# EAGLE design ap_hand_controller_v2 (EAGLE 7.7.0)
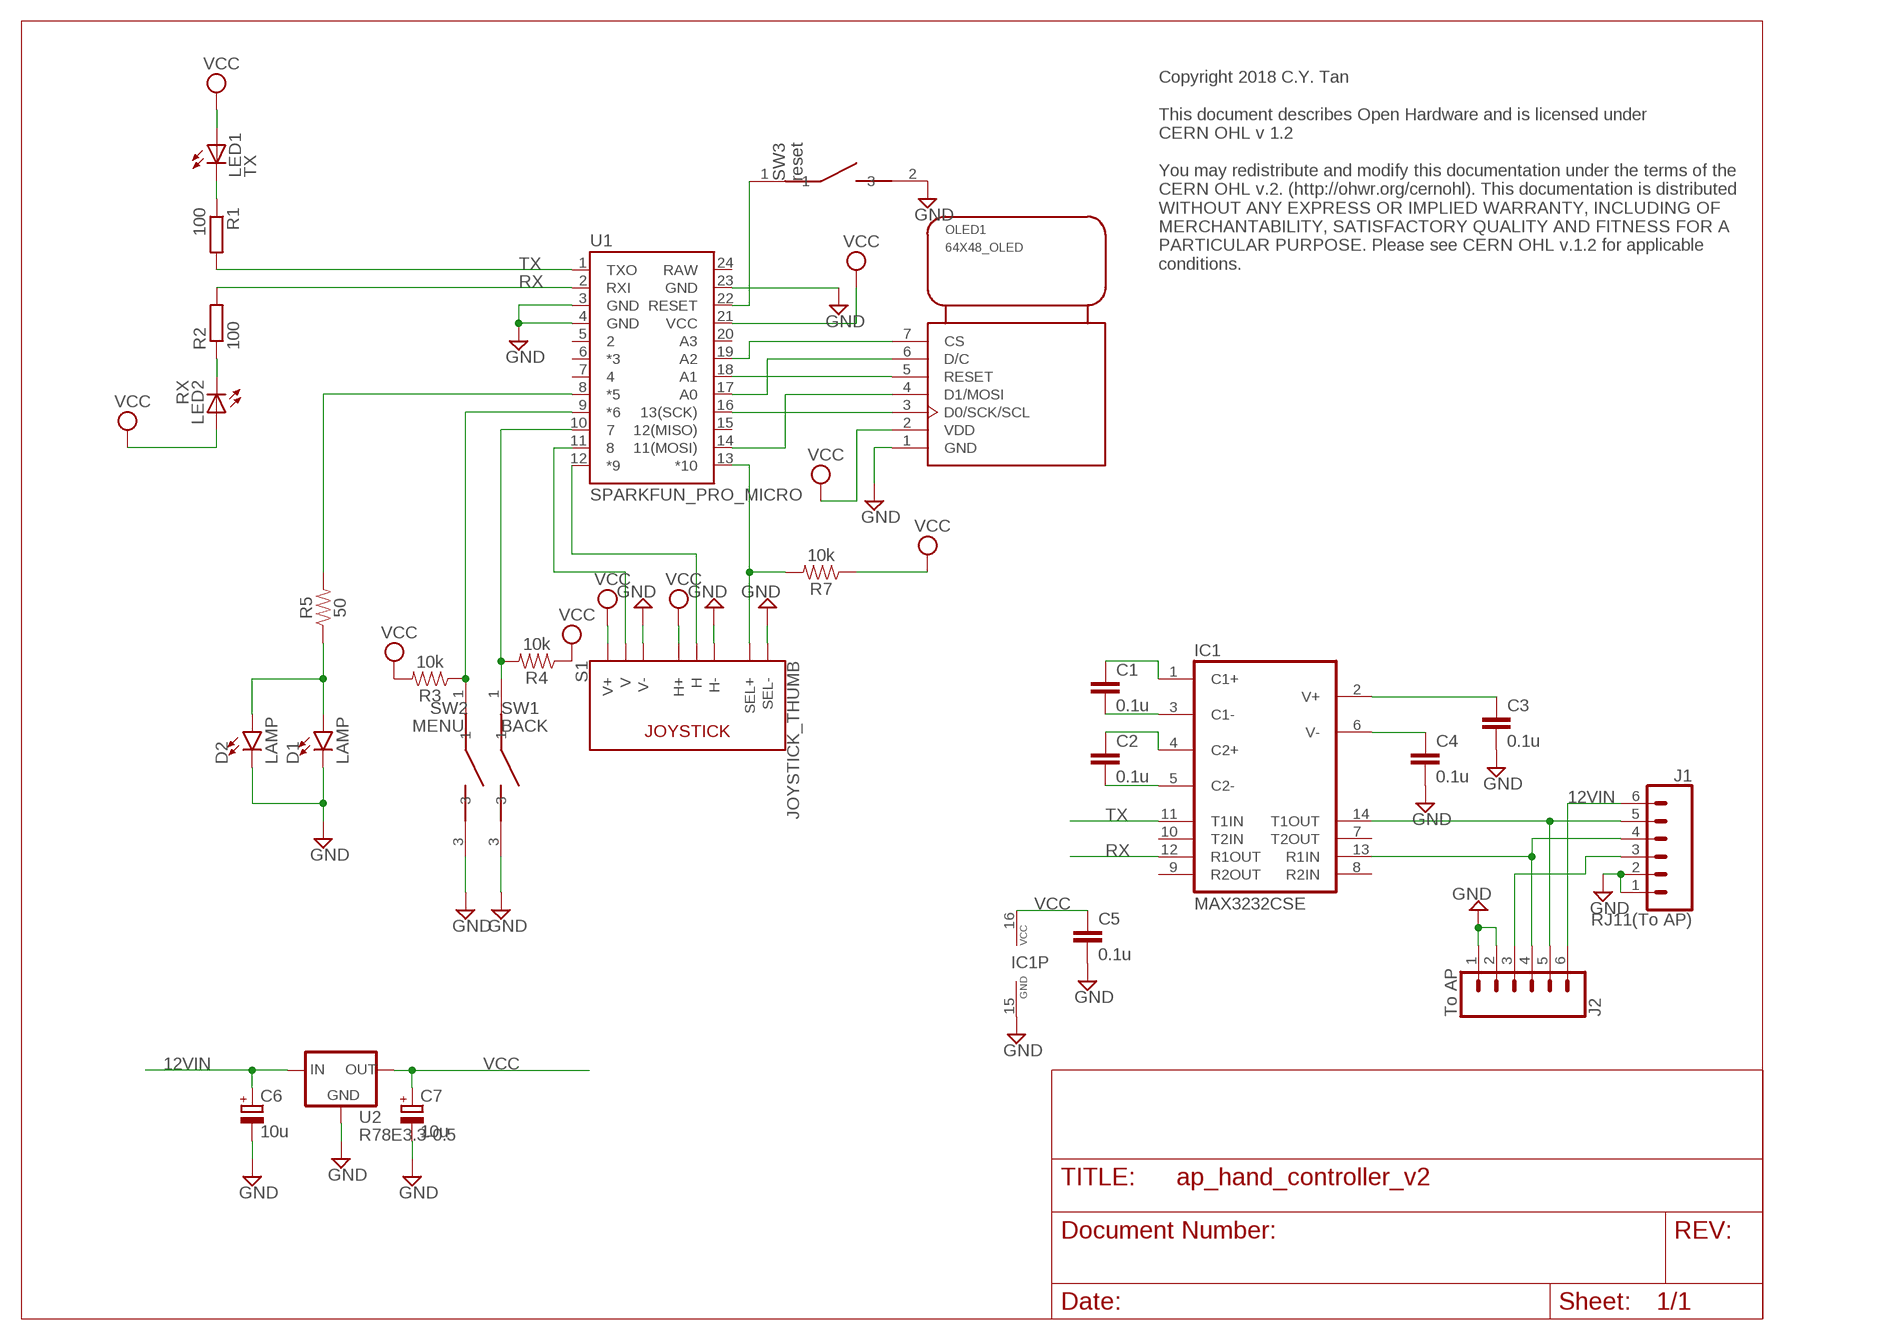
[diagram p0: schematic, sheet 1]

## Parts
C1  0.1u  C-EUC1206  [C1206]
C2  0.1u  C-EUC1206  [C1206]
C3  0.1u  C-EUC1206  [C1206]
C4  0.1u  C-EUC1206  [C1206]
C5  0.1u  C-EUC1206  [C1206]
C6  10u  CPOL-EUE2.5-6  [E2,5-6]
C7  10u  CPOL-EUE2.5-6  [E2,5-6]
D1  LAMP  LED5MM  [LED_5MM]
D2  LAMP  LED5MM  [LED_5MM]
IC1  MAX3232CSE  [SO16]
J1  RJ11(To AP)  RJ11-6  [RJ11-6]
J2  To AP  CONN_06NO_SILK_FEMALE_PTH  [1X06_NO_SILK]
LED1  TX  LEDCHIPLED_1206  [CHIPLED_1206]
LED2  RX  LEDCHIPLED_1206  [CHIPLED_1206]
OLED1  64X48_OLED  [64X48_OLED]
R1  100  R  [R0805]
R2  100  R  [R0805]
R3  10k  RESISTORAXIAL-0.3  [AXIAL-0.3]
R4  10k  RESISTORAXIAL-0.3  [AXIAL-0.3]
R5  50  RESISTORAXIAL-0.3  [AXIAL-0.3]
R7  10k  RESISTORAXIAL-0.3  [AXIAL-0.3]
S1  JOYSTICK_THUMB  [JOYSTICK]
SW1  BACK  TSA12110_TACT_SWITCH  [TSA12110_TACT_SWITCH]
SW2  MENU  TSA12110_TACT_SWITCH  [TSA12110_TACT_SWITCH]
SW3  reset  TACTILE_SWITCH_90DEG  [TACTILE_SWITCH_90DEG]
U1  SPARKFUN_PRO_MICRO  [SPARKFUN_PRO_MICRO]
U2  R78E3.3-0.5  R-78E5.0-1.0  [DC-DC_CONVERTER_78XX]

## Nets
12VIN: C6.+ J1.6 J2.6 U2.VIN(IN)
GND: C3.2 C4.2 C5.2 C6.- C7.- D1.K(C) D2.K(C) IC1.15(GND) J1.1 J1.2 J2.1 J2.2 OLED1.1(GND) S1.B2A(SEL-) S1.H3(H-) S1.V3(V-) SW1.3 SW2.3 SW3.2 U1.3(GND) U1.4(GND) U1.23(GND) U2.GND
N$1: C1.1 IC1.1(C1+)
N$2: C1.2 IC1.3(C1-)
N$3: C2.1 IC1.4(C2+)
N$4: C2.2 IC1.5(C2-)
N$5: C4.1 IC1.6(V-)
N$6: C3.1 IC1.2(V+)
N$7: IC1.14(T1OUT) J1.5 J2.5
N$8: IC1.13(R1IN) J1.4 J2.4
N$9: LED1.C R1.1
N$10: LED2.C R2.1
N$11: S1.V2(V) U1.11
N$12: S1.H2(H) U1.12(*9)
N$13: SW3.1 U1.22(RESET)
N$14: OLED1.3(D0/SCK/SCL) U1.16(13(SCK))
N$15: OLED1.6(D/C) U1.17(A0)
N$16: OLED1.4(D1/MOSI) U1.14(11(MOSI))
N$17: OLED1.5(RESET) U1.18(A1)
N$18: OLED1.7(CS) U1.19(A2)
N$21: R4.P$2 SW1.1 U1.10
N$22: R3.P$1 SW2.1 U1.9(*6)
N$24: D1.A D2.A R5.P$1
N$30: R7.P$2 S1.B1A(SEL+) U1.13(*10)
N$31: J1.3 J2.3
N$32: R5.P$2 U1.8(*5)
RX: IC1.12(R1OUT) R2.2 U1.2(RXI)
TX: IC1.11(T1IN) R1.2 U1.1(TXO)
VCC: C5.1 C7.+ IC1.16(VCC) LED1.A LED2.A OLED1.2(VDD) R3.P$2 R4.P$1 R7.P$1 S1.H1(H+) S1.V1(V+) U1.21(VCC) U2.VOUT(OUT)
Unconnected: IC1.7(T2OUT) IC1.8(R2IN) IC1.9(R2OUT) IC1.10(T2IN) U1.5 U1.6(*3) U1.7 U1.15(12(MISO)) U1.20(A3)

## Notes on the sheet
- Copyright 2018 C.Y. Tan
  
  This document describes Open Hardware and is licensed under
  CERN OHL v 1.2
  
  You may redistribute and modify this documentation under the terms of the 
  CERN OHL v.2. (http://ohwr.org/cernohl). This documentation is distributed
  WITHOUT ANY EXPRESS OR IMPLIED WARRANTY, INCLUDING OF
  MERCHANTABILITY, SATISFACTORY QUALITY AND FITNESS FOR A
  PARTICULAR PURPOSE. Please see CERN OHL v.1.2 for applicable
  conditions.

## Power pins joined to a net without a drawn wire
RAW: U1.24(RAW)

## Library data of the parts
C1-C5 = resistor:C-EU: CAPACITOR, European symbol
C6 C7 = resistor:CPOL-EU: POLARIZED CAPACITOR, European symbol
D1 D2 = SparkFun-LED:LED: LED (Generic) Standard schematic elements and footprints for 5mm, 3mm, 1206, and 0603 sized LEDs. Generic LEDs with no color specified.
IC1 = maxim:MAX3232*: True RS-232 Transceivers 3.0V to 5.5V, Low-Power up to 1Mbps, Using Four 0.1µF External Capacitors Source: http://pdfserv.maxim-ic.com/en/ds/MAX3222-MAX3241.pdf; MPN: MAX3232CSE; OC_FARNELL: 9725490; OC_NEWARK: 90C2890
J1 = SparkFun-Connectors:RJ11-6: RJ11 Jack - 6 pin Commonly found on CAT3 devices and some Microchip programmers. Here is the connector we sell at SparkFun: RJ11 6-Pin Connector <https://www.sparkfun.com/products/132> (PRT-00132) Datasheet <http://www.sparkfun.com/datasheets/Prototyping/Connectors/RJ11-Datasheet.pdf> It is used on this SparkFun product: SparkFun Weather Shield <https://www.sparkfun.com/products/12081> (DEV-12081) Weather Meters <https://www.sparkfun.com/products/8942> (SEN-08942); PROD_ID: CONN-08590; SF_ID: PRT-00132; VALUE: RJ11
J2 = SparkFun-Connectors:CONN_06: Multi connection point. Often used as Generic Header-pin footprint for 0.1 inch spaced/style header connections On any of the 0.1 inch spaced packages, you can populate with these: Break Away Headers - Straight <https://www.sparkfun.com/products/116> (PRT-00116) Break Away Male Headers - Right Angle <https://www.sparkfun.com/products/553> (PRT-00553) Female Headers <https://www.sparkfun.com/products/115> (PRT-00115) Break Away Headers - Machine Pin <https://www.sparkfun.com/products/117> (PRT-00117) Break Away Female Headers - Swiss Machine Pin <https://www.sparkfun.com/products/743> (PRT-00743) Arduino Stackable Header - 6 Pin <https://www.sparkfun.com/products/9280> (PRT-09280) For SCREWTERMINALS and SPRING TERMINALS visit here: Screw Terimnals on SparkFun.com <https://www.sparkfun.com/search/results?term=Screw+Terminals> (5mm/3.5mm/2.54mm spacing) This device is also useful as a general connection point to wire up your design to another part of your project. Our various solder wires solder well into these plated through hole pads. Hook-Up Wire - Assortment (Stranded, 22 AWG) <https://www.sparkfun.com/products/11375> (PRT-11375) Hook-Up Wire - Assortment (Solid Core, 22 AWG) <https://www.sparkfun.com/products/11367> (PRT-11367) View the entire wire category on our website here <https://www.sparkfun.com/categories/141>; PROD_ID: CONN-08437
LED1 LED2 = led:LED: LED OSRAM: - CHIPLED LG R971, LG N971, LY N971, LG Q971, LY Q971, LO R971, LY R971 LH N974, LH R974 LS Q976, LO Q976, LY Q976 LO Q996 - Hyper CHIPLED LW Q18S LB Q993, LB Q99A, LB R99A - SideLED LS A670, LO A670, LY A670, LG A670, LP A670 LB A673, LV A673, LT A673, LW A673 LH A674 LY A675 LS A676, LA A676, LO A676, LY A676, LW A676 LS A679, LY A679, LG A679 - Hyper Micro SIDELED® LS Y876, LA Y876, LO Y876, LY Y876 LT Y87S - SmartLED LW L88C, LW L88S LB L89C, LB L89S, LG L890 LS L89K, LO L89K, LY L89K LS L896, LA L896, LO L896, LY L896 - TOPLED LS T670, LO T670, LY T670, LG T670, LP T670 LSG T670, LSP T670, LSY T670, LOP T670, LYG T670 LG T671, LOG T671, LSG T671 LB T673, LV T673, LT T673, LW T673 LH T674 LS T676, LA T676, LO T676, LY T676, LB T676, LH T676, LSB T676, LW T676 LB T67C, LV T67C, LT T67C, LS T67K, LO T67K, LY T67K, LW E67C LS E67B, LA E67B, LO E67B, LY E67B, LB E67C, LV E67C, LT E67C LW T67C LS T679, LY T679, LG T679 LS T770, LO T770, LY T770, LG T770, LP T770 LB T773, LV T773, LT T773, LW T773 LH T774 LS E675, LA E675, LY E675, LS T675 LS T776, LA T776, LO T776, LY T776, LB T776 LHGB T686 LT T68C, LB T68C - Hyper Mini TOPLED® LB M676 - Mini TOPLED Santana® LG M470 LS M47K, LO M47K, LY M47K Source: http://www.osram.convergy.de LUXEON: - LUMILED® LXK2-PW12-R00, LXK2-PW12-S00, LXK2-PW14-U00, LXK2-PW14-V00 LXK2-PM12-R00, LXK2-PM12-S00, LXK2-PM14-U00 LXK2-PE12-Q00, LXK2-PE12-R00, LXK2-PE12-S00, LXK2-PE14-T00, LXK2-PE14-U00 LXK2-PB12-K00, LXK2-PB12-L00, LXK2-PB12-M00, LXK2-PB14-N00, LXK2-PB14-P00, LXK2-PB14-Q00 LXK2-PR12-L00, LXK2-PR12-M00, LXK2-PR14-Q00, LXK2-PR14-R00 LXK2-PD12-Q00, LXK2-PD12-R00, LXK2-PD12-S00 LXK2-PH12-R00, LXK2-PH12-S00 LXK2-PL12-P00, LXK2-PL12-Q00, LXK2-PL12-R00 Source: www.luxeon.com KINGBRIGHT: KA-3528ASYC Source: www.kingbright.com
OLED1 = cytan:64X48_OLED: Sparkfun Micro OLED Breakout
R1 R2 = eagle-ltspice:R: RESISTOR, European symbol; SPICEMODEL: NONE; SPICEPREFIX: R
R3-R5 R7 = SparkFun-Resistors:RESISTOR: Generic Resistor Package
S1 = SparkFun-Switches:JOYSTICK_THUMB: Analog Thumb Joystick This is a joystick very similar to the ‘analog’ joysticks on PS2 (PlayStation 2) controllers. Directional movements are simply two potentiometers - one for each axis. Pots are ~10k each. This joystick also has a select button that is actuated when the joystick is pressed down. SparkFun Products Thumb Joystick <https://www.sparkfun.com/products/9032> (COM-09032) SparkFun Thumb Joystick Breakout <https://www.sparkfun.com/products/9110> (BOB-09110) SparkFun Joystick Shield Kit <https://www.sparkfun.com/products/9760> (DEV-09760); PROD_ID: COMP-09744; SF_SKU: COM-09032
SW1 SW2 = cytan:TSA12110_TACT_SWITCH: TSA12110 Tactile Switch
SW3 = cytan:TACTILE_SWITCH_90DEG: Tactile switch 90 deg SPST-NO
U1 = SparkFun-Boards:SPARKFUN_PRO_MICRO: SparkFun Pro Micro Atmega32U4 compatible footprint. SparkFun Products: 3.3V/8MHz <https://www.sparkfun.com/products/12587> 5V/16MHz <https://www.sparkfun.com/products/12640>
U2 = SparkFun-IC-Power:R-78E5.0-1.0: Recom Power 5V 1A DC/DC Converter The Recom R-78E5.0-X.X is a compact DC/DC converter module that is a pin for pin drop-in replacement for the LM7805 linear voltage regulator. Specifications: Input Range: 7-28V Output Voltage: 5V Output Current: 1A Max Efficiency: 91% Datasheet <https://www.recom-power.com/pdf/Innoline/R-78Exx-1.0.pdf>; PROD_ID: COM-13655

## Board
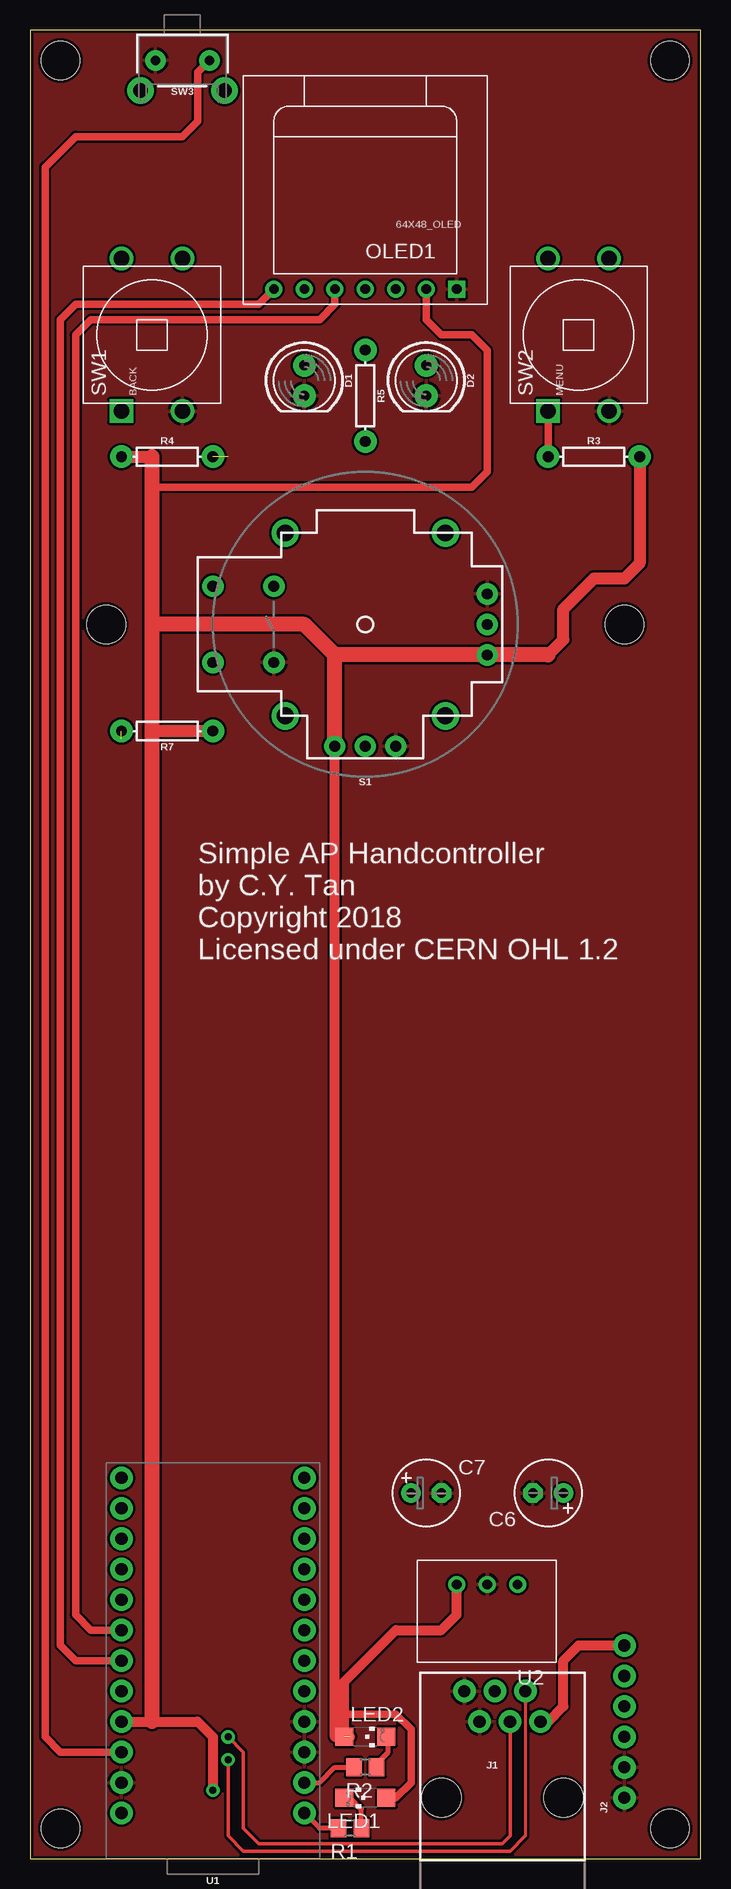
[diagram p1: board, top side]
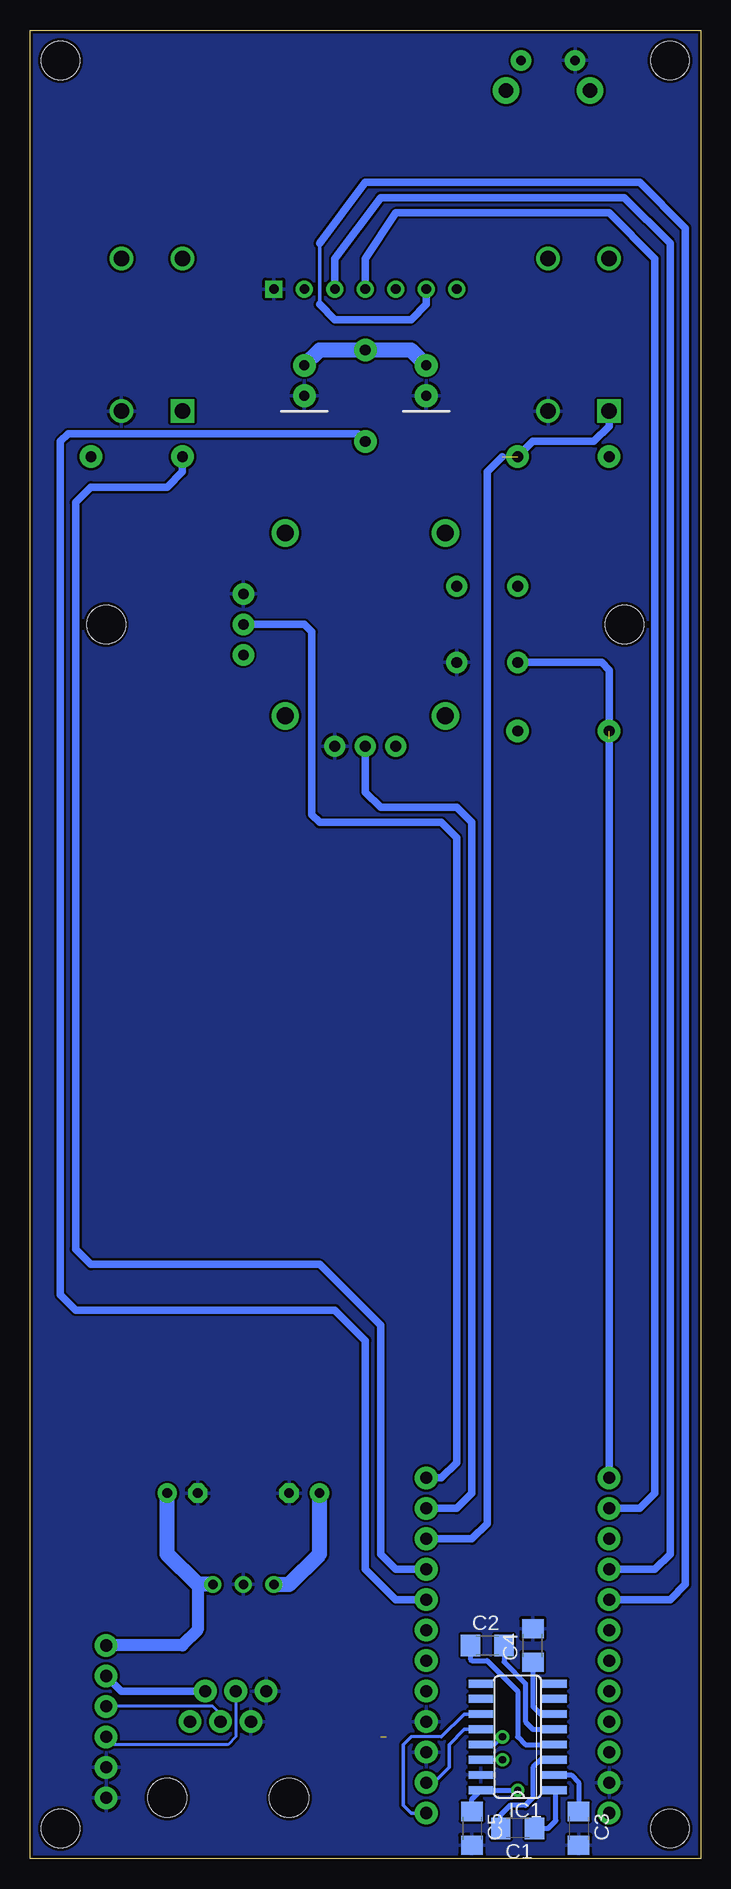
[diagram p2: board, bottom side, seen from below]

Size 55.88 x 152.4 mm. Coordinates in mm from the lower left corner, seen from the top.
Outline: 0,0 55.88,0 55.88,152.4 0,152.4 0,0
Copper layers (1*16): Top 0.035mm / dielectric 1.5mm / Bottom 0.035mm
Design rules "SparkFun": minimum track width 8mil, minimum drill 20mil, track to track 8mil, track to pad 8mil, pad to pad 8mil, via to via 8mil, smd to smd 8mil, copper to edge 10mil, drill to drill 8mil, minimum pad ring 12mil, minimum via ring 10mil, stop-mask expansion 4mil, vias tented up to drill 25mil, thermal gap 10mil
Holes 3.2 mm at 2.54,2.54 53.34,2.54 53.34,149.86 2.54,149.86 6.35,102.87 49.53,102.87

### Footprints (pad centres in the part's own frame; a part is rotated, then mirrored left to right if it is on the bottom)
C1206 = smd 1.6 x 1.8: 1 -1.4,0; 2 1.4,0
E2,5-6 = drill 0.813 pad 1.6: + -1.27,0 | drill 0.813 pad 1.6 octagon: - 1.27,0
LED_5MM = drill 0.813 pad 1.88: A -1.27,0; K 1.27,0
SO16 = smd 0.66 x 2.032: 1 -4.445,-3.073; 2 -3.175,-3.073; 3 -1.905,-3.073; 4 -0.635,-3.073; 5 0.635,-3.073; 6 1.905,-3.073; 7 3.175,-3.073; 8 4.445,-3.073; 9 4.445,3.073; 10 3.175,3.073; 11 1.905,3.073; 12 0.635,3.073; 13 -0.635,3.073; 14 -1.905,3.073; 15 -3.175,3.073; 16 -4.445,3.073
RJ11-6 = drill 1.016 pad 1.88: 1 -3.175,8.89; 2 -1.905,6.35; 3 -0.635,8.89; 4 0.635,6.35; 5 1.905,8.89; 6 3.175,6.35 | hole 3.251: -5.08,0; 5.08,0
1X06_NO_SILK = drill 1.016 pad 1.88: 1 0,0; 2 2.54,0; 3 5.08,0; 4 7.62,0; 5 10.16,0; 6 12.7,0
CHIPLED_1206 = smd 1.5 x 1.5: A 0,-1.75; C 0,1.75
64X48_OLED = drill 0.8 square: 1 -7.62,6.35 | drill 0.8: 2 -5.08,6.35; 3 -2.54,6.35; 4 0,6.35; 5 2.54,6.35; 6 5.08,6.35; 7 7.62,6.35
R0805 = smd 1.3 x 1.5: 1 -0.95,0; 2 0.95,0
AXIAL-0.3 = drill 0.9 pad 1.88: P$1 -3.81,0; P$2 3.81,0
JOYSTICK = drill 0.9 pad 1.778: B1A -3.175,12.7; B1B 3.175,12.7; B2A -3.175,7.62; B2B 3.175,7.62 | drill 0.889 pad 1.778: H1 -2.54,-10.16; H2 0,-10.16; H3 2.54,-10.16; V1 -10.16,2.54; V2 -10.16,0; V3 -10.16,-2.54 | drill 1.397 pad 2.286: MOUNT1 -7.62,6.668; MOUNT2 -7.62,-6.668; MOUNT3 7.62,-6.668; MOUNT4 7.62,6.668
TSA12110_TACT_SWITCH = drill 1.3 square: 1 -6.35,2.54 | drill 1.3: 2 6.35,2.54; 3 -6.35,-2.54; 4 6.35,-2.54
TACTILE_SWITCH_90DEG = drill 0.8 pad 1.7: 1 -2.25,0; 2 2.25,0 | drill 1.2 pad 2.2: ANCHOR1 -3.5,2.5; ANCHOR2 3.5,2.5
SPARKFUN_PRO_MICRO = drill 1.016 pad 1.88: 1 -7.62,12.7; 2 -7.62,10.16; 3 -7.62,7.62; 4 -7.62,5.08; 5 -7.62,2.54; 6 -7.62,0; 7 -7.62,-2.54; 8 -7.62,-5.08; 9 -7.62,-7.62; 10 -7.62,-10.16; 11 -7.62,-12.7; 12 -7.62,-15.24; 13 7.62,-15.24; 14 7.62,-12.7; 15 7.62,-10.16; 16 7.62,-7.62; 17 7.62,-5.08; 18 7.62,-2.54; 19 7.62,0; 20 7.62,2.54; 21 7.62,5.08; 22 7.62,7.62; 23 7.62,10.16; 24 7.62,12.7
DC-DC_CONVERTER_78XX = drill 0.8: GND 0,0; VIN -2.54,0; VOUT 2.54,0

### Placement (x,y rotation side)
C1  15.24,2.54 180 bottom
C2  17.78,17.78 0 bottom
C3  10.16,2.54 270 bottom
C4  13.97,17.78 90 bottom
C5  19.05,2.54 270 bottom
C6  43.18,30.48 180 top
C7  33.02,30.48 0 top
D1  22.86,123.19 270 top
D2  33.02,123.19 270 top
IC1  15.24,10.16 90 bottom
J1  39.37,5.08 0 top
J2  49.53,5.08 90 top
LED1  27.94,5.08 90 top
LED2  27.94,10.16 270 top
OLED1  27.94,137.16 180 top
R1  26.67,2.54 180 top
R2  27.94,7.62 180 top
R3  46.99,116.84 0 top
R4  11.43,116.84 0 top
R5  27.94,121.92 270 top
R7  11.43,93.98 180 top
S1  27.94,102.87 90 top
SW1  10.16,127 90 top
SW2  45.72,127 90 top
SW3  12.7,149.86 180 top
U1  15.24,16.51 180 top
U2  38.1,22.86 180 top

### Tracks (layer width: path | path; a pad name or v marks a point on that pad's centre or on a via)
12VIN
  Top 0.813: J1.6 43.18,11.43 44.45,12.7 44.45,16.51 45.72,17.78 J2.6
  Bottom 1.016: 41.91,22.86 41.91,19.05 43.18,17.78 J2.6
  Bottom 1.27: U2.VIN 41.91,22.86 44.45,25.4 C6.+
GND
  pour Bottom: 0,152.4 55.88,152.4 55.88,0 0,0
  pour Top: 0,152.4 55.88,152.4 55.88,0 0,0
N$1
  Bottom 0.406: C1.1 12.7,2.54 12.06,3.17 12.06,5.61 IC1.1
N$2
  Bottom 0.406: C1.2 16.64,3.68 15.88,4.45 14.61,4.45 13.97,5.08 13.97,7.62 13.34,8.26 IC1.3
N$3
  Bottom 0.406: C2.1 19.18,16.64 19.05,16.51 17.78,16.51 15.24,13.97 15.24,10.16 14.61,9.53 IC1.4
N$4
  Bottom 0.406: C2.2 16.38,16.38 14.61,14.61 14.61,11.43 13.97,10.79 IC1.5
N$5
  Bottom 0.406: 12.06,12.06 IC1.6 13.34,12.06 13.97,12.7 C4.1
N$6
  Bottom 0.406: IC1.2 10.79,6.99 10.16,6.35 C3.1
N$7  (via drill 0.6)
  Top 0.254: J1.5 41.27,1.91
  Top 0.305: 41.27,1.91 40.01,0.64 17.78,0.64 16.51,1.91 v16.51,8.26
  Bottom 0.305: IC1.14 v16.51,8.26
  Bottom 0.61: J1.5 48.26,13.97 J2.5
N$8  (via drill 0.6)
  Top 0.305: J1.4 40.01,1.91 39.37,1.27 19.05,1.27 17.78,2.54 17.78,8.89 v16.51,10.16
  Bottom 0.254: J1.4 40.01,12.06 40.64,12.7 J2.4
  Bottom 0.305: IC1.13 17.14,9.53 v16.51,10.16
N$9
  Top 0.406: R1.1 27.62,4.13 26.67,5.08 LED1.C
N$10
  Top 0.406: R2.1 28.89,7.93 29.84,8.89 29.84,10.01 LED2.C
N$11
  Bottom 0.61: S1.V2 27.94,88.9 26.67,87.63 20.32,87.63 19.05,86.36 19.05,30.48 20.32,29.21 U1.11
N$12
  Bottom 0.61: S1.H2 33.02,102.87 32.38,102.23 32.38,87 31.75,86.36 21.59,86.36 20.32,85.09 20.32,33.02 21.59,31.75 U1.12
N$13
  Top 0.61: U1.22 2.54,8.89 1.27,10.16 1.27,140.97 3.81,143.51 12.7,143.51 13.97,144.78 13.97,148.88 SW3.1
N$14
  Bottom 0.61: U1.16 3.81,24.13 2.54,25.4 2.54,134.62 6.35,138.43 26.67,138.43 30.48,133.35 OLED1.3 30.48,132.08
N$15
  Bottom 0.305: 31.75,134.62 31.75,129.54
  Bottom 0.61: 31.75,134.62 27.94,139.7 5.08,139.7 1.27,135.89 1.27,22.86 2.54,21.59 U1.17 | 31.75,129.54 30.48,128.27 24.13,128.27 22.86,129.54 OLED1.6
N$16
  Bottom 0.61: U1.14 5.08,29.21 3.81,30.48 3.81,133.35 7.62,137.16 25.4,137.16 27.94,133.35 OLED1.4
N$17
  Top 0.61: U1.18 5.08,19.05 3.81,20.32 3.81,127 5.08,128.27 24.13,128.27 25.4,129.54 OLED1.5
N$18
  Top 0.61: U1.19 3.81,16.51 2.54,17.78 2.54,128.27 3.81,129.54 19.05,129.54 OLED1.7
N$21  (1 unrouted)
  Bottom 0.61: 16.51,116.84 17.78,115.57 17.78,27.94 19.05,26.67 U1.10 | SW1.1 7.62,119.38 8.89,118.11 13.97,118.11 R4.P$2
N$22
  Top 0.61: SW2.1 R3.P$1
  Bottom 0.61: U1.9 25.4,24.13 26.67,25.4 26.67,44.45 31.75,49.53 50.8,49.53 52.07,50.8 52.07,113.03 50.8,114.3 44.45,114.3 43.18,115.57 R3.P$1
N$24
  Bottom 1.27: D1.A 24.13,125.73 R5.P$1 31.75,125.73 D2.A
N$30  (1 unrouted)
  Bottom 0.61: U1.13 7.62,93.34 | S1.B1A 8.26,99.69 7.62,99.06 R7.P$2
N$31
  Bottom 0.254: J1.3 38.73,10.16 39.37,9.53 48.9,9.53 J2.3
N$32
  Bottom 0.61: U1.8 25.4,21.59 27.94,24.13 27.94,43.18 30.48,45.72 52.07,45.72 53.34,46.99 53.34,118.11 52.7,118.75 28.57,118.75 R5.P$2
RX
  Top 0.406: U1.2 24.13,6.35 25.4,7.62 R2.2
  Bottom 0.305: IC1.12 19.68,10.79 20.95,9.53 20.95,7.62 22.23,6.35 U1.2
TX
  Top 0.406: R1.2 24.13,2.54 U1.1
  Bottom 0.254: 21.59,10.16 24.13,10.16
  Bottom 0.305: 19.05,12.06 19.68,12.06 21.59,10.16 | 24.13,10.16 24.77,9.53 24.77,4.45 24.13,3.81 U1.1
  Bottom 0.406: IC1.11 19.05,12.06
VCC  (via drill 0.6)  (1 unrouted)
  Top 0.61: LED1.A 30.48,5.08 31.75,6.35 31.75,10.79 30.48,12.06 26.19,12.06 | OLED1.2 33.02,128.27 34.29,127 36.83,127 38.1,125.73 38.1,115.57 36.83,114.3 10.16,114.3
  Top 0.813: LED2.A 26.19,12.06 26.19,14.76 30.48,19.05 34.29,19.05 35.56,20.32 U2.VOUT | U1.21 10.16,11.43 13.97,11.43 15.24,10.16 v15.24,5.71 | 26.67,10.16 25.4,10.16 S1.V1
  Top 1.016: R7.P$1 10.16,93.98 | R4.P$1 10.16,116.84 | R3.P$2 50.8,107.95 49.53,106.68 46.99,106.68 44.45,104.14 44.45,101.6 43.18,100.33
  Top 1.27: 10.16,116.84 10.16,114.3 10.16,102.87 | 10.16,102.87 10.16,93.98 10.16,11.43 | 25.4,100.33 S1.H1 43.18,100.33 | 25.4,100.33 22.86,102.87 10.16,102.87 | S1.V1 25.4,100.33
  Bottom 0.406: C5.1 19.05,4.98 IC1.16 v15.24,5.71
  Bottom 1.27: U2.VOUT 34.29,22.86 31.75,25.4 C7.+

### Text on the board
tNames: Simple AP Handcontroller / by C.Y. Tan / Copyright 2018 / Licensed under CERN OHL 1.2